# Altium schematic sheet Czujnik światłowodowy schemat elektryczny.SchDoc
size A4; SheetNumber: 1; SheetTotal: 1
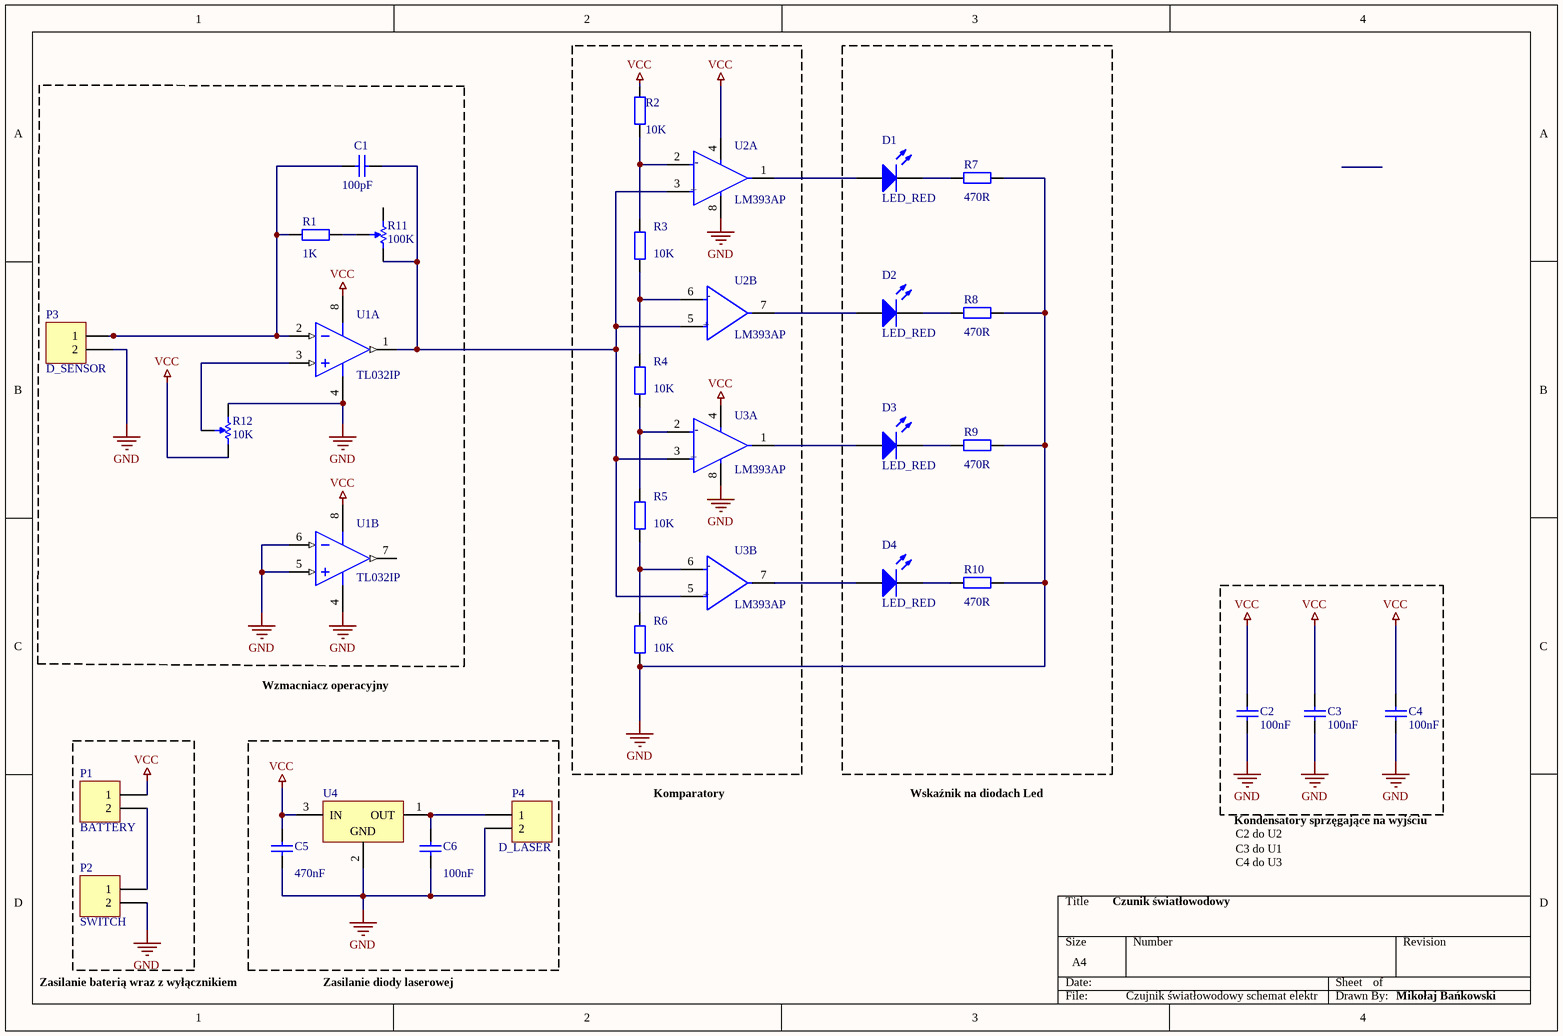
[diagram p0: Czujnik światłowodowy schemat elektryczny.SchDoc]

## Parts
C1  value 100pF  [RAD-0.3]  (hidden comment: Cap)
C2  value 100nF  [RAD-0.3]  (hidden comment: Cap)
C3  value 100nF  [RAD-0.3]  (hidden comment: Cap)
C4  value 100nF  [RAD-0.3]  (hidden comment: Cap)
C5  value 470nF  [RAD-0.3]  (hidden comment: Cap)
C6  value 100nF  [RAD-0.3]  (hidden comment: Cap)
D1  LED_RED  [LED-1]
D2  LED_RED  [LED-1]
D3  LED_RED  [LED-1]
D4  LED_RED  [LED-1]
P1  BATTERY  [HDR1X2]
P2  SWITCH  [HDR1X2]
P3  D_SENSOR  [HDR1X2]
P4  D_LASER  [HDR1X2]
R1  value 1K  [AXIAL-0.4]  (hidden comment: Res2)
R2  value 10K  [AXIAL-0.4]  (hidden comment: Res2)
R3  value 10K  [AXIAL-0.4]  (hidden comment: Res2)
R4  value 10K  [AXIAL-0.4]  (hidden comment: Res2)
R5  value 10K  [AXIAL-0.4]  (hidden comment: Res2)
R6  value 10K  [AXIAL-0.4]  (hidden comment: Res2)
R7  value 470R  [AXIAL-0.4]  (hidden comment: Res2)
R8  value 470R  [AXIAL-0.4]  (hidden comment: Res2)
R9  value 470R  [AXIAL-0.4]  (hidden comment: Res2)
R10  value 470R  [AXIAL-0.4]  (hidden comment: Res2)
R11  100K  [BOUR-3386P]
R12  10K  [BOUR-3386P]
U1  TL032IP  [P0008A]  (parts A,B of 2)
U2  LM393AP  [FP-P0008A-MFG]  (parts A,B of 2)
U3  LM393AP  [FP-P0008A-MFG]  (parts A,B of 2)
U4  LM78L05ACZ/NOPB  [LP0003A]  (value not drawn)

## Nets
GND: C2.2 C3.2 C4.2 C5.2 C6.2 P2.2 P3.2 P4.2 R6.1 R7.2 R8.2 R9.2 R10.2 R12.1 U1.4(VCC-) U1.5(IN2+) U1.6(IN2-) U2.8(VCC) U3.8(VCC) U4.2(GND)
VCC: C2.1 C3.1 C4.1 C5.1 P1.1 R2.2 R12.3 U1.8(VCC+) U2.4(GND) U3.4(GND) U4.3(IN)
NetC1_1: C1.1 P3.1 R1.1 U1.2(IN1-)
NetC1_2: C1.2 R11.3 U1.1(OUT1) U2.3(1IN+) U2.5(2IN+) U3.3(1IN+) U3.5(2IN+)
NetC6_1: C6.1 P4.1 U4.1(OUT)
NetD1_1: D1.1(A) U2.1(1OUT)
NetD1_2: D1.2(K) R7.1
NetD2_1: D2.1(A) U2.7(2OUT)
NetD2_2: D2.2(K) R8.1
NetD3_1: D3.1(A) U3.1(1OUT)
NetD3_2: D3.2(K) R9.1
NetD4_1: D4.1(A) U3.7(2OUT)
NetD4_2: D4.2(K) R10.1
NetP1_2: P1.2 P2.1
NetR1_2: R1.2 R11.2
NetR2_1: R2.1 R3.2 U2.2(1IN-)
NetR3_1: R3.1 R4.2 U2.6(2IN-)
NetR4_1: R4.1 R5.2 U3.2(1IN-)
NetR5_1: R5.1 R6.2 U3.6(2IN-)
NetR12_2: R12.2 U1.3(IN1+)

Not connected (* = marked no-connect by the designer): R11 1; U1 7(OUT2)

## Notes on the sheet
- Wzmacniacz operacyjny
- Komparatory
- Wskaźnik na diodach Led
- Kondensatory sprzęgające na wyjściu
- C2 do U2
- C3 do U1
- Czunik światłowodowy
- C4 do U3
- Zasilanie baterią wraz z wyłącznikiem
- Zasilanie diody laserowej
- Mikołaj Bańkowski
- (in symbol CMP-04896-000062-1, part A) -; +
- (in symbol CMP-04896-000062-1, part B) -; +

## Library data of the parts
C1-C6 = Cap: Capacitor; Published: 8-Jun-2000; LatestRevisionDate: 17-Jul-2002; LatestRevisionNote: Re-released for DXP Platform.; PackageReference: RAD-0.3; Publisher: Altium Limited; PackageDescription: Radial Cap, Thru-Hole; 2 Leads; 0.3 in Pin Spacing
D1-D4 = LED1: Typical RED GaAs LED; Published: 8-Jun-2000; LatestRevisionDate: 08-Jul-2005; LatestRevisionNote: Mech Layer 1 removed.; PackageReference: LED-1; Publisher: Altium Limited; PackageDescription: LED; 2 Leads
P1-P4 = Header 2: Header, 2-Pin; LatestRevisionDate: 17-Jul-2002; LatestRevisionNote: Re-released for DXP Platform.; Publisher: Altium Limited
R1-R10 = Res2: Resistor; Published: 8-Jun-2000; LatestRevisionDate: 17-Jul-2002; LatestRevisionNote: Re-released for DXP Platform.; PackageReference: AXIAL-0.4; Publisher: Altium Limited; PackageDescription: Axial Device, Thru-Hole; 2 Leads; 0.4 in Pin Spacing
R11 R12 = CMP-2000-05592-1: Square Trimpot(R) Trimming Potentiometer, 100 KOhm, +/- 10%, 0.5 W, -55 to 125 degC, 3-Pin THD, RoHS, Tube; Manufacturer Series: 3386; Manufacturer: Bourns; Resistive Element Material: Cermet; Shaft Diameter: 3.15mm; Number of Turns: 1; Product Height: 4.83mm; Temperature Coefficient: 100ppm/C; Product Depth: 9.53mm; Rated Temperature (Cel): 85; Actuator Orientation: Vertical; Resistance (ohm): 100000; Power Rating: 1/2W; Tolerance (%): 10; Rated Power Dissipation (P) (W): 0.5; Resistance Law: Linear; Actuator Type: Screw; Operating Temperature-Min (Cel): -55; Manufacturer URL: http://www.bourns.com/; Terminal Finish: TINLEAD; Datasheet Version: 05/2016; Tolerance: 10%; Lead Free: NO; Family: 3386; Product Length: 9.53mm; Mounting: ThroughHole; Packaging: Tube; Package: RectangularPackage; Mounting Feature: ThroughHole; Number of Terminals: 3; Minimum Operating Temperature: -55C; Mounting Technology: ThroughHole; Package Reference: 3386P; Maximum Operating Temperature: 125C; Termination Style: Pin; Datasheet URL: http://www.bourns.com/docs/Product-Datasheets/3386.pdf; Package Description: 3-Pin Through Hole Device, Body 9.53 x 9.53 mm, Pitch 2.54 mm; Product Type: Potentiometer; Operating Temperature-Max (Cel): 125; Resistance Value: 100KOhm; Terminal Shape: WIRE; Technology: Cermet; Type: Trimmer
U1 = CMP-0017-01026-2: Dual Enhanced JFET Low-Power Precision Operational Amplifier, 10 to 30 V, -40 to 85 degC, 8-pin DIP (P8), Pb-Free (RoHS); Manufacturer: Texas Instruments; CMRR(Min)(dB): 70; Number of Channels: 2; Vio (25C)(Max)(mV): 1.5; Rating: Military; Total Supply Voltage(Min)(+5V is 5, +/-5V is 10): 10; Sub Family: General Purpose Amplifier, High Supply Voltage Amplifier (>=30V), Low Power Amp (<=500uA); Iq per channel(Max)(mA): 0.28; GBW(Typ)(MHz): 1.1; Slew Rate(Typ)(V/us): 5.1; Offset Drift(Typ)(uV/C): 10.8; Total Supply Voltage(Max)(+5V is 5, +/-5V is 10): 30; Vn at 1kHz(Typ)(nV/rtHz): 41; IIB(Max)(pA): 200; PackageVersion: 4040082/E, 04/2010; ComponentLink3URL: http://www.ti.com/litv/pdf/mpdi001b; ComponentLink2URL: http://www.ti.com/lit/ds/symlink/tl032.pdf; PartNumber: TL032IP; DatasheetVersion: SLOS180C; ComponentLink1URL: http://www.ti.com/; Eco-Plan: Pb-Free (RoHS); ComponentLink2Description: Datasheet; Code_JEDEC: MS-001; PackageDescription: 8-Pin Plastic In-Line, Body 9.59 x 6.35 mm, Pitch 2.54 mm; Mounting Technology: Through Hole; ComponentLink3Description: Package Specification; ComponentLink1Description: Manufacturer URL; PackageReference: P0008A
U2 U3 = CMP-04896-000062-1: IC DUAL DIFF COMPARATOR 8-DIP; Voltage Gain: 106.02dB; Response Time: 0.3us; Nominal Supply Current: 1mA; Max Input Current: 250nA; Max Supply Current: 500uA; Output Current per Channel: 6mA; Max Dual Supply Voltage: 18V; Output Current: 20mA; Input Offset Voltage (Vos): 2mV; Output Type: TTL; Number of Elements: 2; Min Supply Voltage: 2V; Max Supply Voltage: 30V; Min Dual Supply Voltage: 1V; Quiescent Current: 2.5mA; Mount: Through Hole; REACH SVHC: No SVHC; RoHS Compliant: Yes; Max Operating Temperature: 70°C; Packaging: Rail/Tube; Case/Package: PDIP; Number of Pins: 8; Radiation Hardening: No; Contact Plating: Gold; Weight: 0.015535oz; Lead Free: Lead Free; Number of Channels: 2; Min Operating Temperature: 0°C; Input Bias Current: 250nA; Package Quantity: 50; Type: General Purpose
U4 = CMP-0062-00040-4: 3-Terminal Positive Regulator, 5 Vout, 3-pin TO-92, Pb-Free; Manufacturer: Texas Instruments; High-Reliability: Y; PackageTopMarking: NSXYTT*LM78L*05ACZ; CompType: LDO IC; PowerWise: N; Code_JEDEC: TO-226-AA; ComponentLink1Description: Datasheet URL; PartNumber: LM78L05ACZ/NOPB; RoHS: Y; PinCount: 3; PackageDescription: TO-92, Molded, 3 Lead; ComponentLink1URL: http://www.ti.com/general/docs/lit/getliterature.tsp?genericPartNumber=LM78L05&fileType=pdf; PackageReference: LP0003A